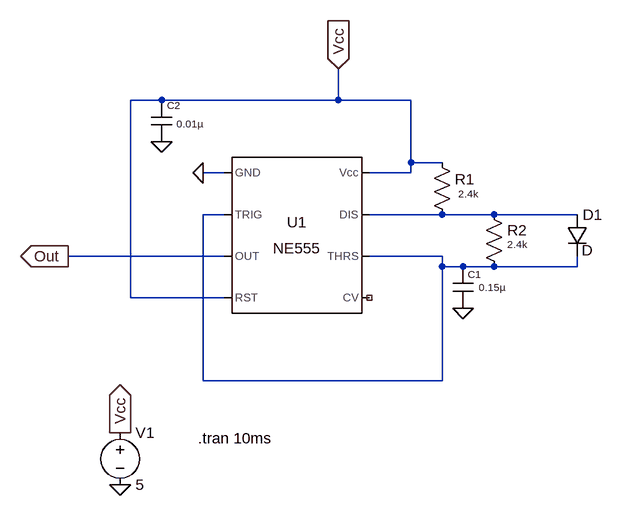
[diagram p0: schematic P2.asc]
P2.asc, the LTspice schematic file:
Version 4
SHEET 1 880 680
WIRE 16 -32 -32 -32
WIRE 288 -32 288 -80
WIRE 288 -32 16 -32
WIRE 400 -32 288 -32
WIRE 400 64 400 -32
WIRE 448 64 400 64
WIRE 112 80 80 80
WIRE 400 80 400 64
WIRE 400 80 336 80
WIRE 112 144 80 144
WIRE 448 144 336 144
WIRE 528 144 448 144
WIRE 656 144 528 144
WIRE 112 208 -128 208
WIRE 448 208 336 208
WIRE 448 224 448 208
WIRE 480 224 448 224
WIRE 528 224 480 224
WIRE 656 224 656 208
WIRE 656 224 528 224
WIRE -32 272 -32 -32
WIRE 112 272 -32 272
WIRE 80 400 80 144
WIRE 448 400 448 224
WIRE 448 400 80 400
FLAG 288 -80 Vcc
IOPIN 288 -80 In
FLAG 480 288 0
FLAG 80 80 0
FLAG 16 32 0
FLAG -128 208 Out
IOPIN -128 208 Out
FLAG -48 480 Vcc
IOPIN -48 480 Out
FLAG -48 560 0
SYMBOL Misc\\NE555 224 176 R0
SYMATTR InstName U1
SYMBOL res 432 48 R0
WINDOW 0 51 26 Top 2
WINDOW 3 56 54 Top 1
SYMATTR InstName R1
SYMATTR Value 2.4k
SYMBOL diode 640 144 R0
WINDOW 3 23 55 Left 2
SYMATTR InstName D1
SYMBOL res 512 128 R0
WINDOW 3 36 62 Left 1
SYMATTR Value 2.4k
SYMATTR InstName R2
SYMBOL cap 464 224 R0
WINDOW 0 23 12 Left 1
WINDOW 3 40 32 Left 1
SYMATTR InstName C1
SYMATTR Value 0.15µ
SYMBOL cap 0 -32 R0
WINDOW 0 24 8 Left 1
WINDOW 3 39 36 Left 1
SYMATTR InstName C2
SYMATTR Value 0.01µ
SYMBOL voltage -48 464 R0
WINDOW 123 0 0 Left 0
WINDOW 39 0 0 Left 0
SYMATTR InstName V1
SYMATTR Value 5
TEXT 72 488 Left 2 !.tran 10ms

The netlist it stands for:
* P2.asc
XU1 0 N001 Out Vcc NC_01 N001 N002 Vcc NE555  ; pins GND TRIG OUT RST CV THRS DIS Vcc
R1 Vcc N002 2.4k
D1 N002 N001 D
R2 N002 N001 2.4k
C1 N001 0 0.15µ
C2 Vcc 0 0.01µ
V1 Vcc 0 5
.model D D
.lib standard.dio
.tran 10ms
.lib NE555.sub
.backanno
.end